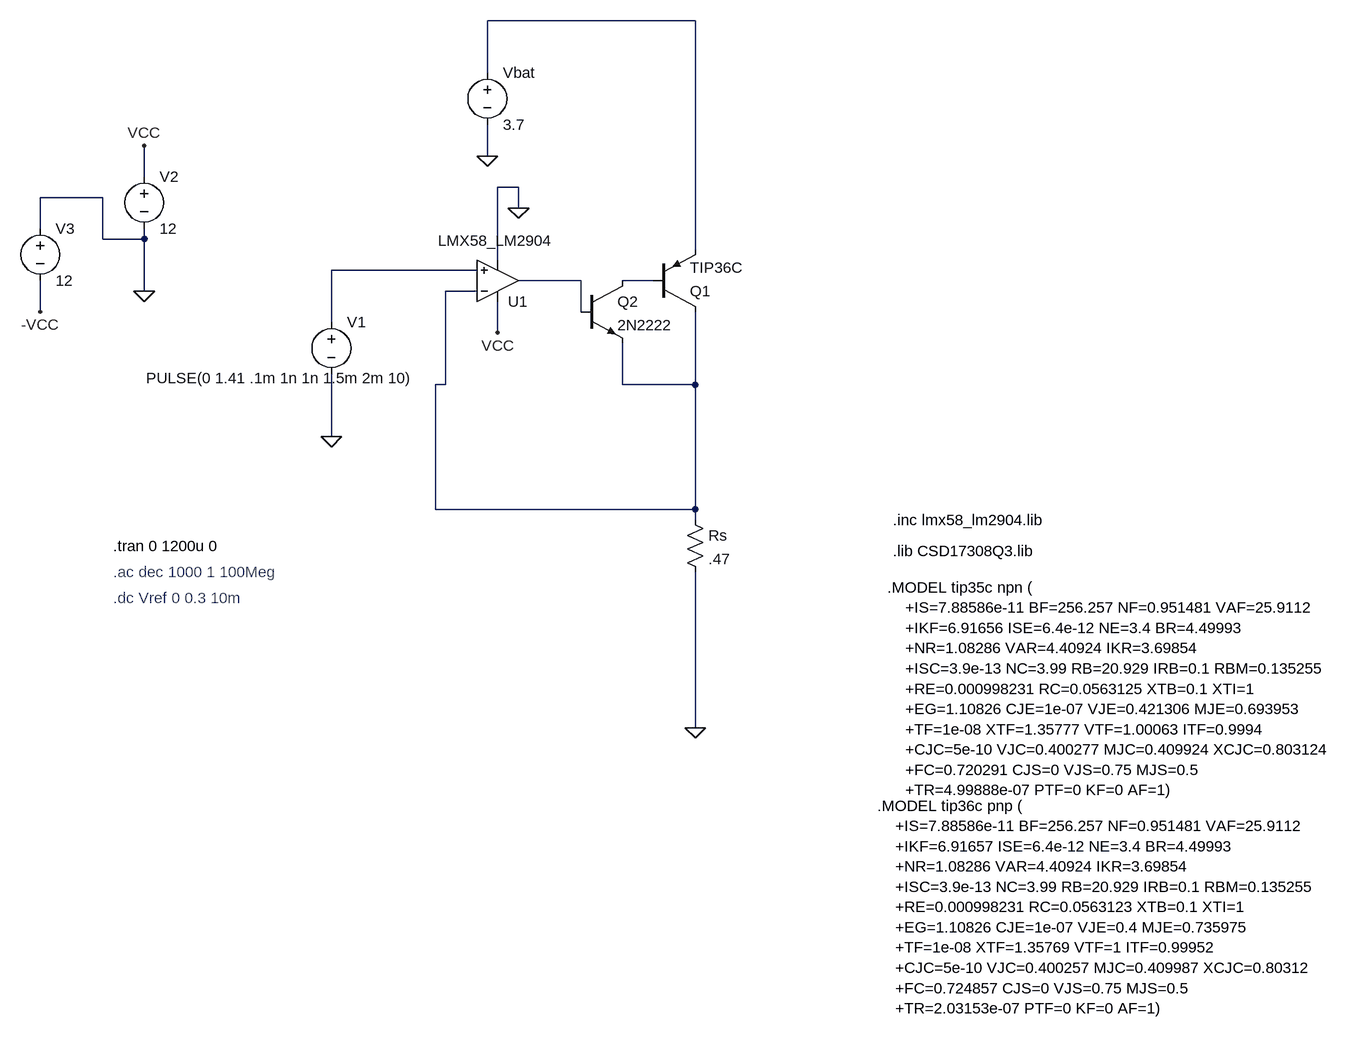
[diagram p0: schematic modulo_descarga_tbj.asc]
modulo_descarga_tbj.asc, the LTspice schematic file:
Version 4.1
SHEET 1 2224 680
WIRE 944 -912 624 -912
WIRE 624 -832 624 -912
WIRE 624 -704 624 -752
WIRE 96 -672 96 -720
WIRE 672 -656 640 -656
WIRE 32 -640 -64 -640
WIRE 672 -624 672 -656
WIRE -64 -592 -64 -640
WIRE 32 -576 32 -640
WIRE 96 -576 96 -592
WIRE 96 -576 32 -576
WIRE 944 -560 944 -912
WIRE 640 -544 640 -656
WIRE 608 -528 384 -528
WIRE 768 -512 672 -512
WIRE 880 -512 832 -512
WIRE 96 -496 96 -576
WIRE 608 -496 560 -496
WIRE -64 -464 -64 -512
WIRE 768 -464 768 -512
WIRE 384 -448 384 -528
WIRE 640 -432 640 -480
WIRE 560 -352 560 -496
WIRE 560 -352 544 -352
WIRE 832 -352 832 -416
WIRE 944 -352 944 -464
WIRE 944 -352 832 -352
WIRE 384 -272 384 -368
WIRE 544 -160 544 -352
WIRE 944 -160 944 -352
WIRE 944 -160 544 -160
WIRE 944 -144 944 -160
WIRE 944 176 944 -64
FLAG 944 176 0
FLAG 96 -720 VCC
FLAG 96 -496 0
FLAG 640 -432 VCC
FLAG 384 -272 0
FLAG 624 -704 0
FLAG -64 -464 -VCC
FLAG 672 -624 0
SYMBOL OpAmps\\opamp2 640 -448 M180
WINDOW 3 -92 126 Left 2
SYMATTR Value LMX58_LM2904
SYMATTR InstName U1
SYMBOL voltage 96 -688 R0
WINDOW 123 0 0 Left 0
WINDOW 39 0 0 Left 0
SYMATTR InstName V2
SYMATTR Value 12
SYMBOL res 928 -160 R0
SYMATTR InstName Rs
SYMATTR Value .47
SYMBOL voltage 624 -848 R0
WINDOW 123 0 0 Left 0
WINDOW 39 0 0 Left 0
SYMATTR InstName Vbat
SYMATTR Value 3.7
SYMBOL voltage -64 -608 R0
WINDOW 123 0 0 Left 0
WINDOW 39 0 0 Left 0
SYMATTR InstName V3
SYMATTR Value 12
SYMBOL voltage 384 -464 R0
WINDOW 3 -285 102 Left 2
WINDOW 123 0 0 Left 0
WINDOW 39 0 0 Left 0
SYMATTR InstName V1
SYMATTR Value PULSE(0 1.41 .1m 1n 1n 1.5m 2m 10)
SYMBOL pnp 880 -464 M180
SYMATTR InstName Q1
SYMATTR Value TIP36C
SYMBOL npn 768 -512 R0
SYMATTR InstName Q2
SYMATTR Value 2N2222
TEXT 1248 -144 Left 2 !.inc lmx58_lm2904.lib
TEXT 48 -104 Left 2 !.tran 0 1200u 0
TEXT 48 -64 Left 2 ;.ac dec 1000 1 100Meg
TEXT 1248 -96 Left 2 !.lib CSD17308Q3.lib
TEXT 48 -24 Left 2 ;.dc Vref 0 0.3 10m
TEXT 1240 -40 Left 2 !.MODEL tip35c npn (\n    +IS=7.88586e-11 BF=256.257 NF=0.951481 VAF=25.9112\n    +IKF=6.91656 ISE=6.4e-12 NE=3.4 BR=4.49993\n    +NR=1.08286 VAR=4.40924 IKR=3.69854\n    +ISC=3.9e-13 NC=3.99 RB=20.929 IRB=0.1 RBM=0.135255\n    +RE=0.000998231 RC=0.0563125 XTB=0.1 XTI=1\n    +EG=1.10826 CJE=1e-07 VJE=0.421306 MJE=0.693953\n    +TF=1e-08 XTF=1.35777 VTF=1.00063 ITF=0.9994\n    +CJC=5e-10 VJC=0.400277 MJC=0.409924 XCJC=0.803124\n    +FC=0.720291 CJS=0 VJS=0.75 MJS=0.5\n    +TR=4.99888e-07 PTF=0 KF=0 AF=1)
TEXT 1224 296 Left 2 !.MODEL tip36c pnp (\n    +IS=7.88586e-11 BF=256.257 NF=0.951481 VAF=25.9112\n    +IKF=6.91657 ISE=6.4e-12 NE=3.4 BR=4.49993\n    +NR=1.08286 VAR=4.40924 IKR=3.69854\n    +ISC=3.9e-13 NC=3.99 RB=20.929 IRB=0.1 RBM=0.135255\n    +RE=0.000998231 RC=0.0563123 XTB=0.1 XTI=1\n    +EG=1.10826 CJE=1e-07 VJE=0.4 MJE=0.735975\n    +TF=1e-08 XTF=1.35769 VTF=1 ITF=0.99952\n    +CJC=5e-10 VJC=0.400257 MJC=0.409987 XCJC=0.80312\n    +FC=0.724857 CJS=0 VJS=0.75 MJS=0.5\n    +TR=2.03153e-07 PTF=0 KF=0 AF=1)

The netlist it stands for:
* modulo_descarga_tbj.asc
X§U1 N002 N005 VCC 0 N003 LMX58_LM2904  ; pins In+ In- V+ V- OUT
V2 VCC 0 12
Rs N005 0 .47
Vbat N001 0 3.7
V3 0 -VCC 12
V1 N002 0 PULSE(0 1.41 .1m 1n 1n 1.5m 2m 10)
Q1 N005 N004 N001 0 TIP36C
Q2 N004 N003 N005 0 2N2222
.model NPN NPN
.model PNP PNP
.lib standard.bjt
.inc lmx58_lm2904.lib
.tran 0 1200u 0
* .ac dec 1000 1 100Meg
.lib CSD17308Q3.lib
* .dc Vref 0 0.3 10m
.MODEL tip35c npn (
    +IS=7.88586e-11 BF=256.257 NF=0.951481 VAF=25.9112
    +IKF=6.91656 ISE=6.4e-12 NE=3.4 BR=4.49993
    +NR=1.08286 VAR=4.40924 IKR=3.69854
    +ISC=3.9e-13 NC=3.99 RB=20.929 IRB=0.1 RBM=0.135255
    +RE=0.000998231 RC=0.0563125 XTB=0.1 XTI=1
    +EG=1.10826 CJE=1e-07 VJE=0.421306 MJE=0.693953
    +TF=1e-08 XTF=1.35777 VTF=1.00063 ITF=0.9994
    +CJC=5e-10 VJC=0.400277 MJC=0.409924 XCJC=0.803124
    +FC=0.720291 CJS=0 VJS=0.75 MJS=0.5
    +TR=4.99888e-07 PTF=0 KF=0 AF=1)
.MODEL tip36c pnp (
    +IS=7.88586e-11 BF=256.257 NF=0.951481 VAF=25.9112
    +IKF=6.91657 ISE=6.4e-12 NE=3.4 BR=4.49993
    +NR=1.08286 VAR=4.40924 IKR=3.69854
    +ISC=3.9e-13 NC=3.99 RB=20.929 IRB=0.1 RBM=0.135255
    +RE=0.000998231 RC=0.0563123 XTB=0.1 XTI=1
    +EG=1.10826 CJE=1e-07 VJE=0.4 MJE=0.735975
    +TF=1e-08 XTF=1.35769 VTF=1 ITF=0.99952
    +CJC=5e-10 VJC=0.400257 MJC=0.409987 XCJC=0.80312
    +FC=0.724857 CJS=0 VJS=0.75 MJS=0.5
    +TR=2.03153e-07 PTF=0 KF=0 AF=1)
.backanno
.end